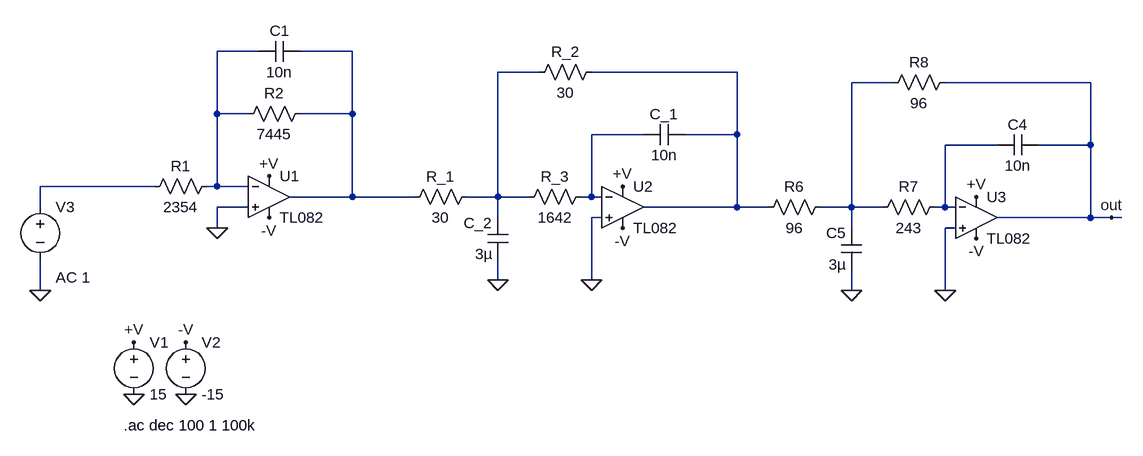
[diagram p0: schematic IIorderFilter.asc]
IIorderFilter.asc, the LTspice schematic file:
Version 4
SHEET 1 952 680
WIRE -432 -160 -496 -160
WIRE -288 -160 -368 -160
WIRE 0 -128 -64 -128
WIRE 304 -128 80 -128
WIRE 544 -112 480 -112
WIRE 848 -112 624 -112
WIRE -496 -64 -496 -160
WIRE -448 -64 -496 -64
WIRE -288 -64 -288 -160
WIRE -288 -64 -368 -64
WIRE 160 -32 80 -32
WIRE 304 -32 304 -128
WIRE 304 -32 224 -32
WIRE 704 -16 624 -16
WIRE 848 -16 848 -112
WIRE 848 -16 768 -16
WIRE -592 48 -768 48
WIRE -496 48 -496 -64
WIRE -496 48 -512 48
WIRE -448 48 -496 48
WIRE -288 64 -288 -64
WIRE -288 64 -384 64
WIRE -192 64 -288 64
WIRE -64 64 -64 -128
WIRE -64 64 -112 64
WIRE -16 64 -64 64
WIRE 80 64 80 -32
WIRE 80 64 64 64
WIRE 96 64 80 64
WIRE -768 80 -768 48
WIRE -448 80 -496 80
WIRE 304 80 304 -32
WIRE 304 80 160 80
WIRE 352 80 304 80
WIRE 480 80 480 -112
WIRE 480 80 432 80
WIRE 528 80 480 80
WIRE 624 80 624 -16
WIRE 624 80 608 80
WIRE 640 80 624 80
WIRE -64 96 -64 64
WIRE 96 96 80 96
WIRE 848 96 848 -16
WIRE 848 96 704 96
WIRE 880 96 848 96
WIRE 896 96 880 96
WIRE -496 112 -496 80
WIRE 480 112 480 80
WIRE 640 112 624 112
WIRE -64 192 -64 160
WIRE 80 192 80 96
WIRE -768 208 -768 160
WIRE 480 208 480 176
WIRE 624 208 624 112
FLAG -416 32 +V
FLAG -624 288 +V
FLAG -416 96 -V
FLAG -544 288 -V
FLAG -624 368 0
FLAG -544 368 0
FLAG 128 48 +V
FLAG 128 112 -V
FLAG -496 112 0
FLAG 80 192 0
FLAG -64 192 0
FLAG -768 208 0
FLAG 672 64 +V
FLAG 672 128 -V
FLAG 624 208 0
FLAG 480 208 0
FLAG 880 96 out
SYMBOL TL082 -416 64 R0
SYMATTR InstName U1
SYMBOL TL082 128 80 R0
SYMATTR InstName U2
SYMBOL res -496 32 R90
WINDOW 0 0 56 VBottom 2
WINDOW 3 32 56 VTop 2
SYMATTR InstName R1
SYMATTR Value 2354
SYMBOL res -352 -80 R90
WINDOW 0 0 56 VBottom 2
WINDOW 3 32 56 VTop 2
SYMATTR InstName R2
SYMATTR Value 7445
SYMBOL cap -368 -176 R90
WINDOW 0 0 32 VBottom 2
WINDOW 3 32 32 VTop 2
SYMATTR InstName C1
SYMATTR Value 10n
SYMBOL voltage -624 272 R0
WINDOW 123 0 0 Left 0
WINDOW 39 0 0 Left 0
SYMATTR InstName V1
SYMATTR Value 15
SYMBOL voltage -544 272 R0
WINDOW 123 0 0 Left 0
WINDOW 39 0 0 Left 0
SYMATTR InstName V2
SYMATTR Value -15
SYMBOL res -96 48 R90
WINDOW 0 0 56 VBottom 2
WINDOW 3 32 56 VTop 2
SYMATTR InstName R_1
SYMATTR Value 30
SYMBOL res 80 48 R90
WINDOW 0 0 56 VBottom 2
WINDOW 3 32 56 VTop 2
SYMATTR InstName R_3
SYMATTR Value 1642
SYMBOL res 96 -144 R90
WINDOW 0 0 56 VBottom 2
WINDOW 3 32 56 VTop 2
SYMATTR InstName R_2
SYMATTR Value 30
SYMBOL cap 224 -48 R90
WINDOW 0 0 32 VBottom 2
WINDOW 3 32 32 VTop 2
SYMATTR InstName C_1
SYMATTR Value 10n
SYMBOL cap -48 160 R180
WINDOW 0 24 56 Left 2
WINDOW 3 24 8 Left 2
SYMATTR InstName C_2
SYMATTR Value 3µ
SYMBOL voltage -768 64 R0
WINDOW 123 24 124 Left 2
WINDOW 39 0 0 Left 0
SYMATTR Value2 AC 1
SYMATTR InstName V3
SYMATTR Value ""
SYMBOL TL082 672 96 R0
SYMATTR InstName U3
SYMBOL res 448 64 R90
WINDOW 0 0 56 VBottom 2
WINDOW 3 32 56 VTop 2
SYMATTR InstName R6
SYMATTR Value 96
SYMBOL res 624 64 R90
WINDOW 0 0 56 VBottom 2
WINDOW 3 32 56 VTop 2
SYMATTR InstName R7
SYMATTR Value 243
SYMBOL res 640 -128 R90
WINDOW 0 0 56 VBottom 2
WINDOW 3 32 56 VTop 2
SYMATTR InstName R8
SYMATTR Value 96
SYMBOL cap 768 -32 R90
WINDOW 0 0 32 VBottom 2
WINDOW 3 32 32 VTop 2
SYMATTR InstName C4
SYMATTR Value 10n
SYMBOL cap 496 176 R180
WINDOW 0 24 56 Left 2
WINDOW 3 24 8 Left 2
SYMATTR InstName C5
SYMATTR Value 3µ
TEXT -640 416 Left 2 !.ac dec 100 1 100k

The netlist it stands for:
* IIorderFilter.asc
* U1: TL082 (symbol TL082 not available, pins judged from their places): In+=0 In-=N001 V+=+V V-=-V OUT=N002
* U2: TL082 (symbol TL082 not available, pins judged from their places): In+=0 In-=N006 V+=+V V-=-V OUT=N004
R1 N001 N008 2354
R2 N002 N001 7445
C1 N002 N001 10n
V1 +V 0 15
V2 -V 0 -15
R_1 N003 N002 30
R_3 N006 N003 1642
R_2 N004 N003 30
C_1 N004 N006 10n
C_2 0 N003 3µ
V3 N008 0 AC 1
* U3: TL082 (symbol TL082 not available, pins judged from their places): In+=0 In-=N007 V+=+V V-=-V OUT=out
R6 N005 N004 96
R7 N007 N005 243
R8 out N005 96
C4 out N007 10n
C5 0 N005 3µ
.ac dec 100 1 100k
.backanno
.end